# EAGLE schematic mowgli (EAGLE 7.6.0)
ABBREV: jn6; PROJECT: JeeNode v6
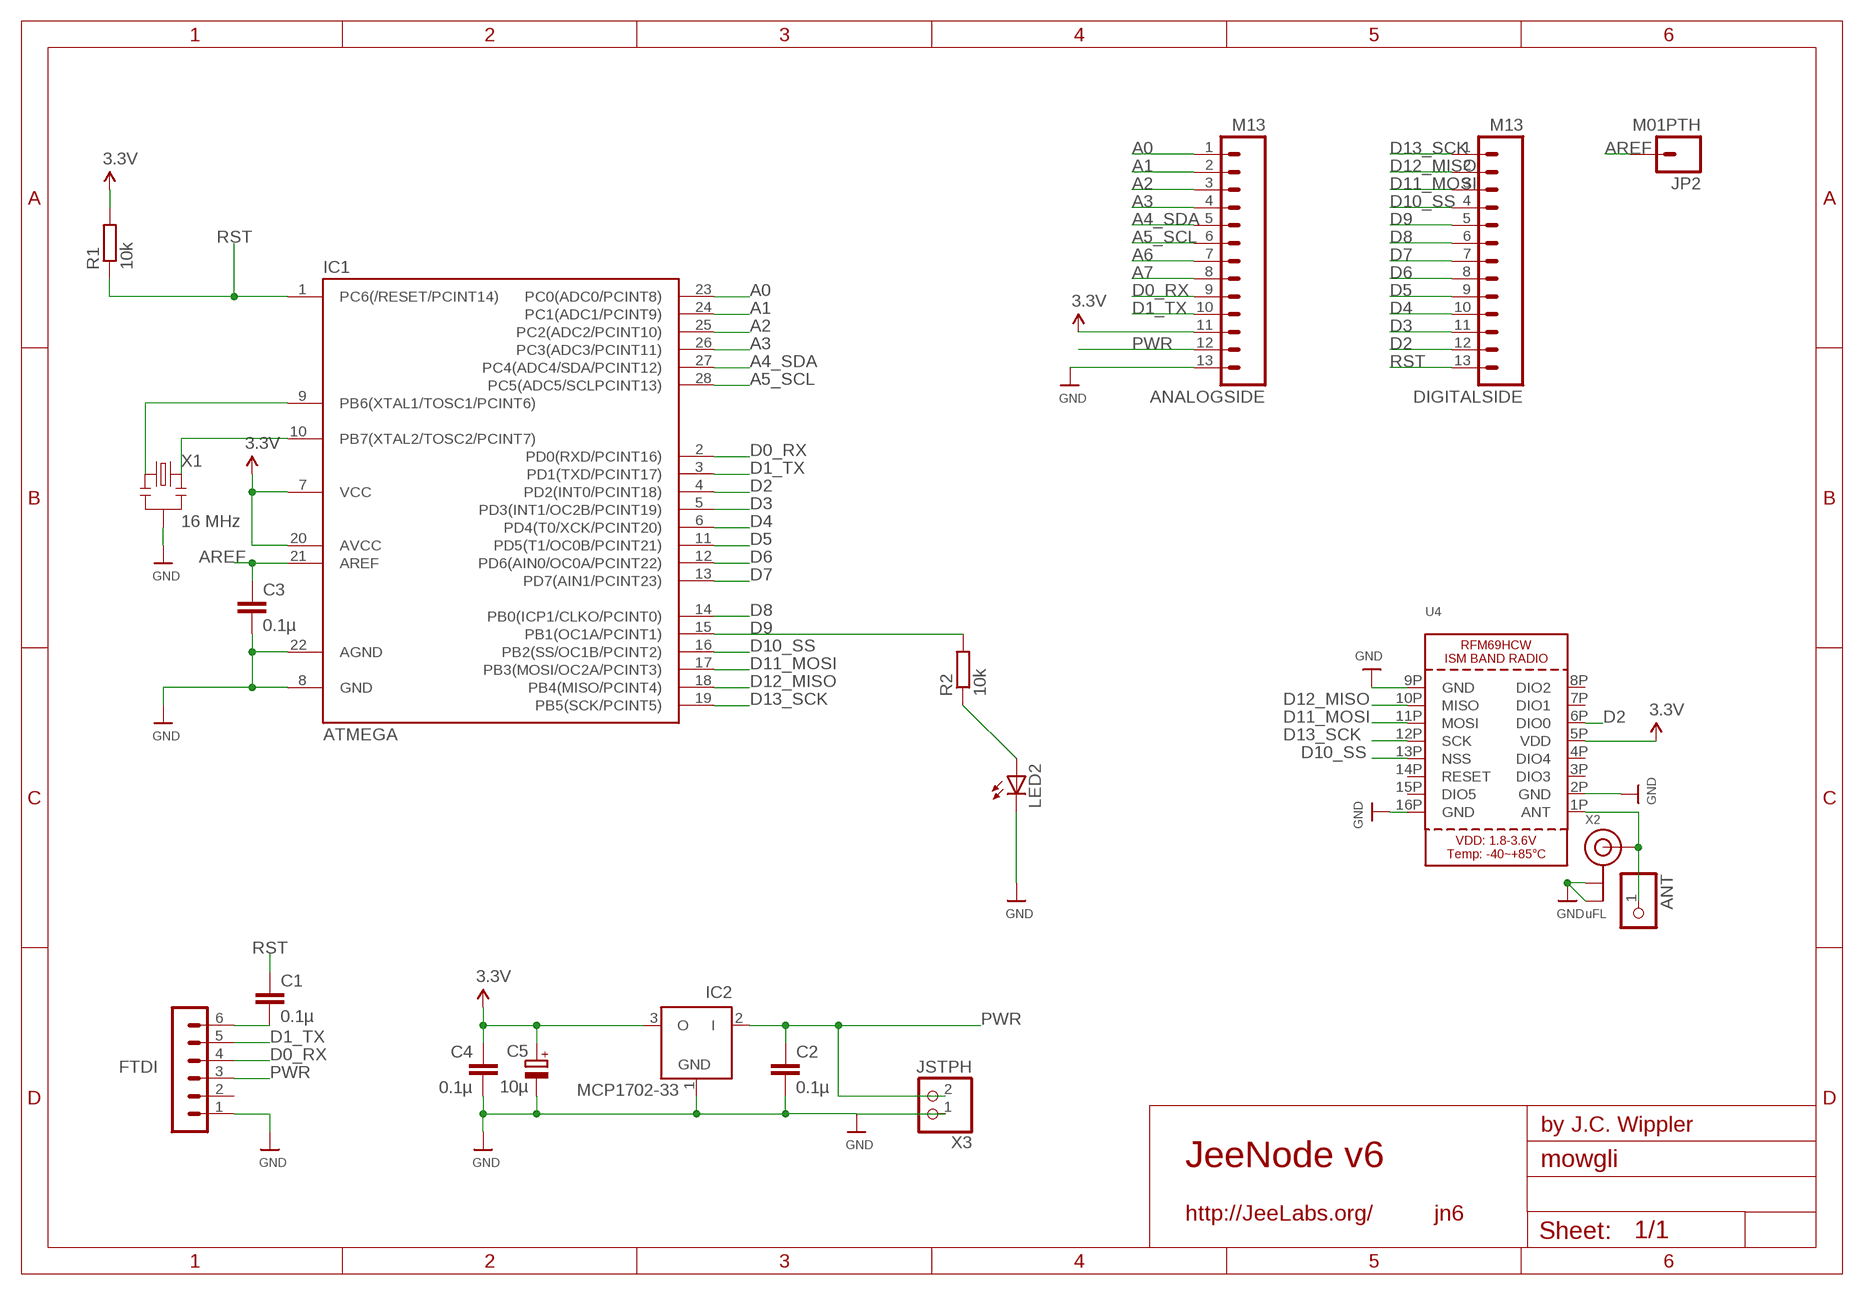
[diagram p0: schematic, sheet 1]

## Parts
ANALOGSIDE  M13  [1X13]
ANT  HEADER-1X1ROUND  [1X01_ROUND]
C1  0.1µ  C-EU025-024X044  [C025-024X044]
C2  0.1µ  C-EU025-024X044  [C025-024X044]
C3  0.1µ  C-EU025-024X044  [C025-024X044]
C4  0.1µ  C-EU025-024X044  [C025-024X044]
C5  10µ  CPOL-EUE1.8-4  [E1,8-4]
DIGITALSIDE  M13  [1X13]
FTDI  FTDI  MA06-1  [MA06-1]
IC1  ATMEGA  ATMEGA48/88/168-PU  [DIL28-3]
IC2  MCP1702-33  MCP1702Z  [TO92]
JP2  M01PTH  [1X01]
LED2  LED3MM  [LED3MM]
R1  10k  R-EU_0204/7  [0204/7]
R2  10k  R-EU_0204/7  [0204/7]
U4  RFM69HCW_SMT  [RFMHCW_SMT]
X1  16 MHz  RESONATORPTH  [RESONATOR-PTH]
X2  uFL  ANTENNA_U.FL  [U.FL]
X3  JSTPH  CON_JST_PH_2PIN  [JSTPH2]

## Nets
A0: ANALOGSIDE.1 IC1.23(PC0(ADC0/PCINT8))
A1: ANALOGSIDE.2 IC1.24(PC1(ADC1/PCINT9))
A2: ANALOGSIDE.3 IC1.25(PC2(ADC2/PCINT10))
A3: ANALOGSIDE.4 IC1.26(PC3(ADC3/PCINT11))
A4_SDA: ANALOGSIDE.5 IC1.27(PC4(ADC4/SDA/PCINT12))
A5_SCL: ANALOGSIDE.6 IC1.28(PC5(ADC5/SCLPCINT13))
A6: ANALOGSIDE.7
A7: ANALOGSIDE.8
ANT: ANT.1 U4.1P(ANT) X2.3(SIGNAL)
AREF: C3.1 IC1.21(AREF) JP2.1
D0_RX: ANALOGSIDE.9 FTDI.4 IC1.2(PD0(RXD/PCINT16))
D1_TX: ANALOGSIDE.10 FTDI.5 IC1.3(PD1(TXD/PCINT17))
D2: DIGITALSIDE.12 IC1.4(PD2(INT0/PCINT18)) U4.6P(DIO0)
D3: DIGITALSIDE.11 IC1.5(PD3(INT1/OC2B/PCINT19))
D4: DIGITALSIDE.10 IC1.6(PD4(T0/XCK/PCINT20))
D5: DIGITALSIDE.9 IC1.11(PD5(T1/OC0B/PCINT21))
D6: DIGITALSIDE.8 IC1.12(PD6(AIN0/OC0A/PCINT22))
D7: DIGITALSIDE.7 IC1.13(PD7(AIN1/PCINT23))
D8: DIGITALSIDE.6 IC1.14(PB0(ICP1/CLKO/PCINT0))
D9: DIGITALSIDE.5 IC1.15(PB1(OC1A/PCINT1)) R2.2
D10_SS: DIGITALSIDE.4 IC1.16(PB2(SS/OC1B/PCINT2)) U4.13P(NSS)
D11_MOSI: DIGITALSIDE.3 IC1.17(PB3(MOSI/OC2A/PCINT3)) U4.11P(MOSI)
D12_MISO: DIGITALSIDE.2 IC1.18(PB4(MISO/PCINT4)) U4.10P(MISO)
D13_SCK: DIGITALSIDE.1 IC1.19(PB5(SCK/PCINT5)) U4.12P(SCK)
GND [power]: ANALOGSIDE.13 C2.2 C3.2 C4.2 C5.- FTDI.1 IC1.8(GND) IC1.22(AGND) IC2.1(GND) LED2.K(C) U4.2P(GND) U4.9P(GND) U4.16P(GND) X1.2 X2.1(GND) X2.2(GND) X3.1
N$1: IC1.9(PB6(XTAL1/TOSC1/PCINT6)) X1.1
N$2: LED2.A R2.1
N$20: C1.2 FTDI.6
N$21: IC1.10(PB7(XTAL2/TOSC2/PCINT7)) X1.3
PWR [power]: ANALOGSIDE.12 C2.1 FTDI.3 IC2.2(I) X3.2
RST: C1.1 DIGITALSIDE.13 IC1.1(PC6(/RESET/PCINT14)) R1.1
VCC [power]: ANALOGSIDE.11 C4.1 C5.+ IC1.7(VCC) IC1.20(AVCC) IC2.3(O) R1.2 U4.5P(VDD) ; supply symbol labelled 3.3V
Unconnected: FTDI.2 U4.3P(DIO3) U4.4P(DIO4) U4.7P(DIO1) U4.8P(DIO2) U4.14P(RESET) U4.15P(DIO5)

## Library data of the parts
ANALOGSIDE DIGITALSIDE = SparkFun-Connectors:M13: 13-pin single row .1" header
ANT = microbuilder:HEADER-1X1: PIN HEADER
C1-C4 = resistor:C-EU: CAPACITOR, European symbol
C5 = resistor:CPOL-EU: POLARIZED CAPACITOR, European symbol
FTDI = JeeLabs:MA06-1: PIN HEADER
IC1 = atmega8:ATMEGA48/88/168-PU
IC2 = JeeLabs:MCP1702: 200 mA, Low Power Low Dropout Voltage Regulator
JP2 = SparkFun-Connectors:M01: Header 1 Standard 1-pin 0.1" header. Use with straight break away headers (SKU : PRT-00116), right angle break away headers (PRT-00553), swiss pins (PRT-00743), machine pins (PRT-00117), and female headers (PRT-00115).
LED2 = led:LED: LED OSRAM: - CHIPLED LG R971, LG N971, LY N971, LG Q971, LY Q971, LO R971, LY R971 LH N974, LH R974 LS Q976, LO Q976, LY Q976 LO Q996 - Hyper CHIPLED LW Q18S LB Q993, LB Q99A, LB R99A - SideLED LS A670, LO A670, LY A670, LG A670, LP A670 LB A673, LV A673, LT A673, LW A673 LH A674 LY A675 LS A676, LA A676, LO A676, LY A676, LW A676 LS A679, LY A679, LG A679 - Hyper Micro SIDELED® LS Y876, LA Y876, LO Y876, LY Y876 LT Y87S - SmartLED LW L88C, LW L88S LB L89C, LB L89S, LG L890 LS L89K, LO L89K, LY L89K LS L896, LA L896, LO L896, LY L896 - TOPLED LS T670, LO T670, LY T670, LG T670, LP T670 LSG T670, LSP T670, LSY T670, LOP T670, LYG T670 LG T671, LOG T671, LSG T671 LB T673, LV T673, LT T673, LW T673 LH T674 LS T676, LA T676, LO T676, LY T676, LB T676, LH T676, LSB T676, LW T676 LB T67C, LV T67C, LT T67C, LS T67K, LO T67K, LY T67K, LW E67C LS E67B, LA E67B, LO E67B, LY E67B, LB E67C, LV E67C, LT E67C LW T67C LS T679, LY T679, LG T679 LS T770, LO T770, LY T770, LG T770, LP T770 LB T773, LV T773, LT T773, LW T773 LH T774 LS E675, LA E675, LY E675, LS T675 LS T776, LA T776, LO T776, LY T776, LB T776 LHGB T686 LT T68C, LB T68C - Hyper Mini TOPLED® LB M676 - Mini TOPLED Santana® LG M470 LS M47K, LO M47K, LY M47K Source: http://www.osram.convergy.de LUXEON: - LUMILED® LXK2-PW12-R00, LXK2-PW12-S00, LXK2-PW14-U00, LXK2-PW14-V00 LXK2-PM12-R00, LXK2-PM12-S00, LXK2-PM14-U00 LXK2-PE12-Q00, LXK2-PE12-R00, LXK2-PE12-S00, LXK2-PE14-T00, LXK2-PE14-U00 LXK2-PB12-K00, LXK2-PB12-L00, LXK2-PB12-M00, LXK2-PB14-N00, LXK2-PB14-P00, LXK2-PB14-Q00 LXK2-PR12-L00, LXK2-PR12-M00, LXK2-PR14-Q00, LXK2-PR14-R00 LXK2-PD12-Q00, LXK2-PD12-R00, LXK2-PD12-S00 LXK2-PH12-R00, LXK2-PH12-S00 LXK2-PL12-P00, LXK2-PL12-Q00, LXK2-PL12-R00 Source: www.luxeon.com KINGBRIGHT: KA-3528ASYC Source: www.kingbright.com
R1 R2 = resistor:R-EU_: RESISTOR, European symbol
U4 = microbuilder:RFM69HCW: RFM69HCW - ISM Band RF Transceiver
X1 = SparkFun:RESONATOR: Resonator Small SMD resonator. This is the itty bitty 10/20MHz resonators with built in caps. CSTCE10M0G55 and CSTCE20M0V53. Footprint has been reviewed closely but hasn't been tested yet.
X2 = microbuilder:ANTENNA_U.FL: U.FL Antenna Connector
X3 = microbuilder:CON_JST_PH_2PIN: JST 2-Pin Right-Angle Connector PH-Series - 4UConnector: 17311 SH-Series - 4UConnector: 07278

## Net classes
1 power: width 0.381 mm, clearance 0.254 mm